# EAGLE design routeur3a (EAGLE 6.6.0)
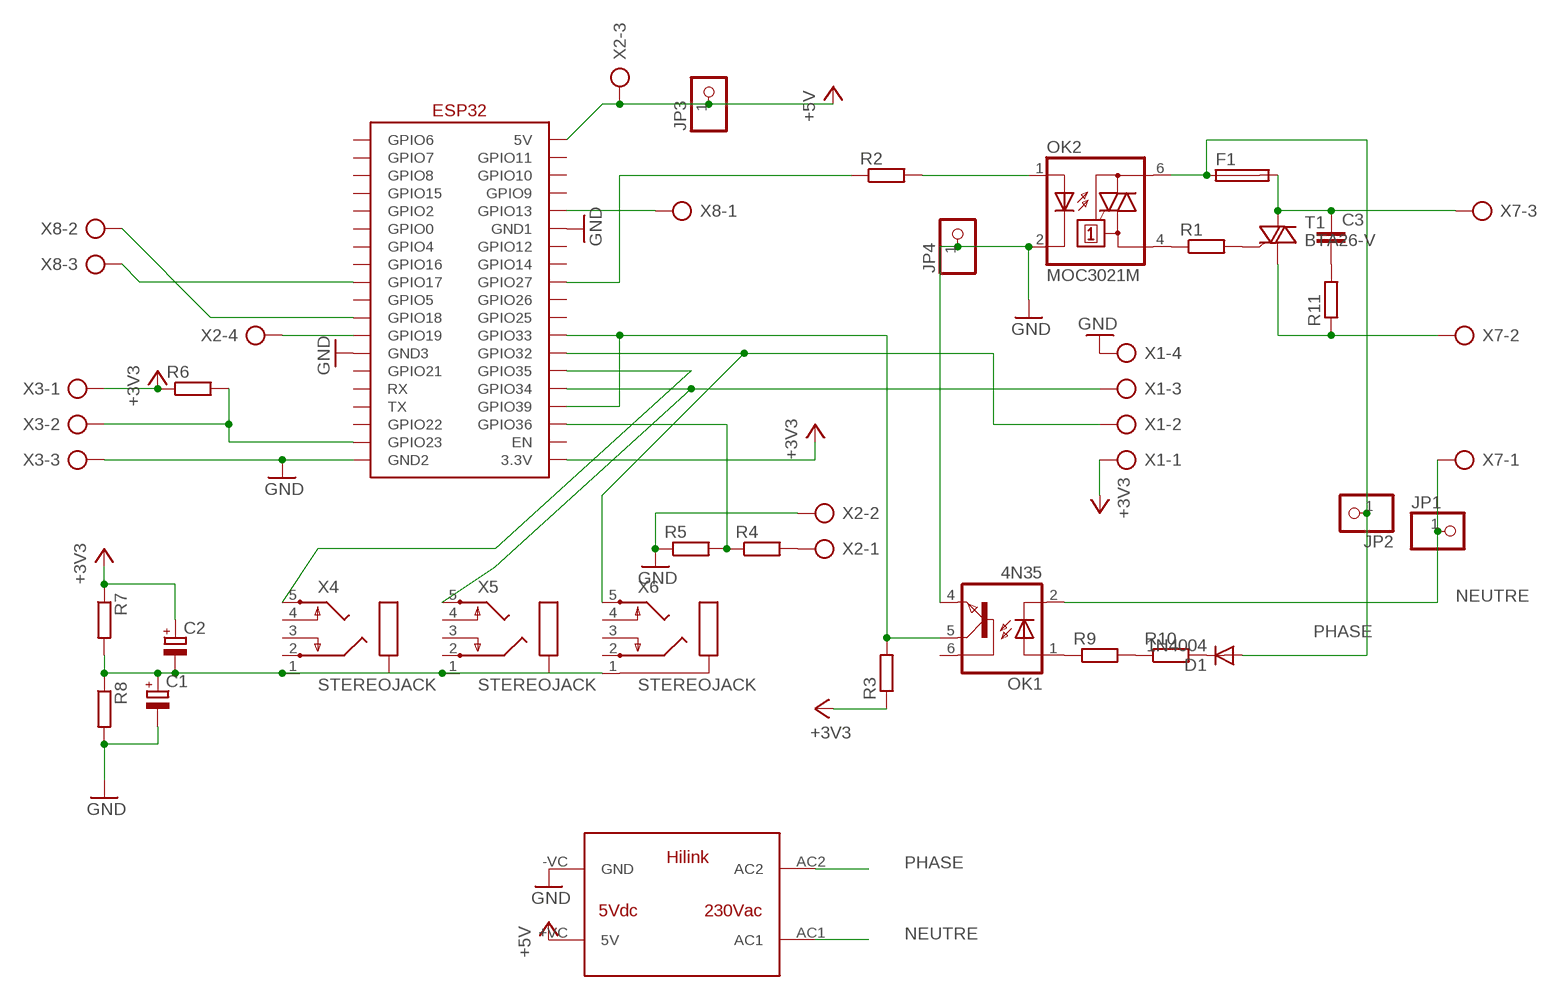
[diagram p0: schematic, sheet 1]

## Parts
C1  CPOL-EUE5-8.5  [E5-8,5]
C2  CPOL-EUE5-8.5  [E5-8,5]
C3  C-EU150-072X183  [C150-072X183]
D1  1N4004  [DO41-10]
F1  19560  [19560]
JP1  PINHD-1X1  [1X01]
JP2  PINHD-1X1  [1X01]
JP3  PINHD-1X1  [1X01]
JP4  PINHD-1X1  [1X01]
OK1  4N35  [DIL06]
OK2  MOC3021M  [DIL06]
R1  R-EU_0207/10  [0207/10]
R2  R-EU_R1206  [R1206]
R3  R-EU_R1206  [R1206]
R4  R-EU_R1206  [R1206]
R5  R-EU_R1206  [R1206]
R6  R-EU_R1206  [R1206]
R7  R-EU_R1206  [R1206]
R8  R-EU_R1206  [R1206]
R9  R-EU_0207/10  [0207/10]
R10  R-EU_0207/10  [0207/10]
R11  R-EU_0817/22  [P0817/22]
T1  BTA26-V  [TOP3S-1]
U$1  WEMOSD1ESP32  [WEMOS-D1-MINI]
U$2  HILINK  [HILINK]
X1  AK500/4  [AK500/4]
X2  AK500/4  [AK500/4]
X3  AK500/3  [AK500/3]
X4  STEREOJACK  [STX3100]
X5  STEREOJACK  [STX3100]
X6  STEREOJACK  [STX3100]
X7  AK500/3  [AK500/3]
X8  AK500/3  [AK500/3]

## Nets
+3V3: C2.+ R3.1 R6.1 R7.1 U$1.3V3(3.3V) X1.1 X3.1
+5V: JP3.1 U$1.VCC(5V) U$2.+VC(5V) X2.3
GND: C1.- JP4.1 OK1.4(EMI) OK2.2(C) R5.1 R8.2 U$1.GND2 U$1.GND3 U$1.GND(GND1) U$2.-VC(GND) X1.4 X2.2 X3.3
N$1: OK2.4(A1) R1.1
N$2: OK2.1(A) R2.2
N$3: R4.2 X2.1
N$4: R1.2 T1.G
N$5: C3.1 F1.2 T1.A2 X7.3
N$6: R11.1 T1.A1 X7.2
N$7: OK1.1(A) R9.1
N$8: R9.2 R10.1
N$9: U$1.TCK(GPIO13) X8.1
N$10: D1.C R10.2
N$14: C1.+ C2.- R7.2 R8.1 X4.1 X5.1 X6.1
N$16: C3.2 R11.2
N$17: U$1.35(GPIO35) X4.5
NEUTRE: JP1.1 OK1.2(C) U$2.AC1 X7.1
PHASE: D1.A F1.1 JP2.1 OK2.6(A2) U$2.AC2
PINCE: U$1.32(GPIO32) X1.2 X6.5
PINCEREF: U$1.34(GPIO34) X1.3 X5.5
PZEMRX: U$1.17(GPIO17) X8.3
PZEMTX: U$1.18(GPIO18) X8.2
RELAIS: U$1.19(GPIO19) X2.4
TEMP: R6.2 U$1.23(GPIO23) X3.2
TENSION: R4.1 R5.2 U$1.SVP(GPIO36)
TRIAC: R2.1 U$1.27(GPIO27)
ZC: OK1.5(COL) R3.2 U$1.33(GPIO33) U$1.SUN(GPIO39)
Unconnected: OK1.6(BAS) U$1.00(GPIO0) U$1.02(GPIO2) U$1.04(GPIO4) U$1.05(GPIO5) U$1.16(GPIO16) U$1.21(GPIO21) U$1.22(GPIO22) U$1.25(GPIO25) U$1.26(GPIO26) U$1.CLK(GPIO6) U$1.CMD(GPIO11) U$1.RST(EN) U$1.RXD(RX) U$1.SD1(GPIO8) U$1.SD2(GPIO9) U$1.SD3(GPIO10) U$1.SDO(GPIO7) U$1.TDI(GPIO12) U$1.TDO(GPIO15) U$1.TMS(GPIO14) U$1.TXD(TX) X4.2 X4.3 X4.4 X5.2 X5.3 X5.4 X6.2 X6.3 X6.4

## Library data of the parts
C1 C2 = rcl:CPOL-EU: POLARIZED CAPACITOR, European symbol
C3 = rcl:C-EU: CAPACITOR, European symbol
D1 = diode:1N4004: DIODE general purpose rectifier, 1 A
F1 = fuse:19560: FUSE HOLDER TR5, Wickmann; MPN: 56000001009; OC_FARNELL: 1185363; OC_NEWARK: 15P8392
JP1-JP4 = adafruit:PINHD-1X1: Pin header 1x1 for 0.1" spacing With round pins
OK1 = optocoupler:4N35: MOTOROLA OPTO COUPLER; MF: FAIRCHILD SEMICONDUCTOR; MPN: 4N35; OC_FARNELL: 1328375; OC_NEWARK: 72K9946
OK2 = optocoupler:MOC30*M: RANDOM-PHASE OPTOISOLATORS TRIAC DRIVER OUTPUT Source: http://www.fairchildsemi.com MOC3020-M.pdf; MF: FAIRCHILD SEMICONDUCTOR; MPN: MOC3021-M; OC_FARNELL: 1021365; OC_NEWARK: 95B7895
R1 R9 R10 = rcl:R-EU_: RESISTOR, European symbol
R2-R8 R11 = resistor:R-EU_: RESISTOR, European symbol
T1 = triac:BTA26: 25A TRIAC Source: http://www.st.com/stonline/products/literature/ds/7470.pdf
U$1 = esp32:WEMOSD1ESP32
U$2 = hilink:HILINK
X1 X2 = con-ptr500:AK500/4: CONNECTOR; OC_FARNELL: unknown; OC_NEWARK: unknown
X3 X7 X8 = con-ptr500:AK500/3: CONNECTOR; OC_FARNELL: unknown; OC_NEWARK: unknown
X4-X6 = adafruit:STEREOJACK: MIC/HEADPHONE JACK Stereo jack with two switches. Kycon STX3100, CUI SJ1-3555NG and/or 4UCon 05544

## Board
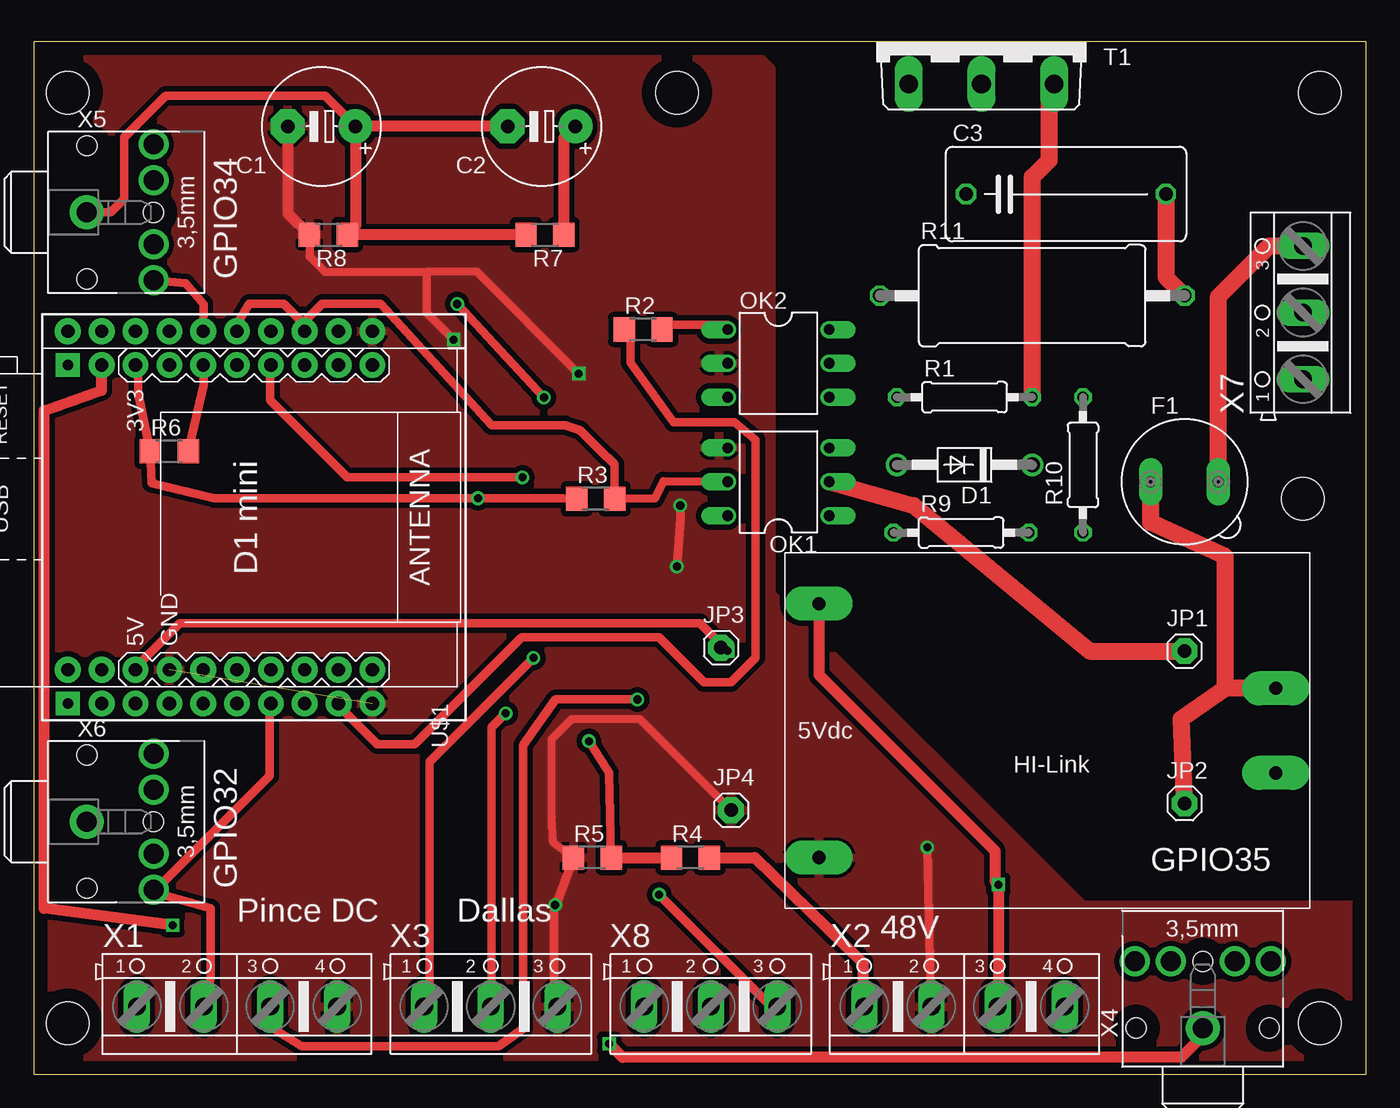
[diagram p1: board, top side]
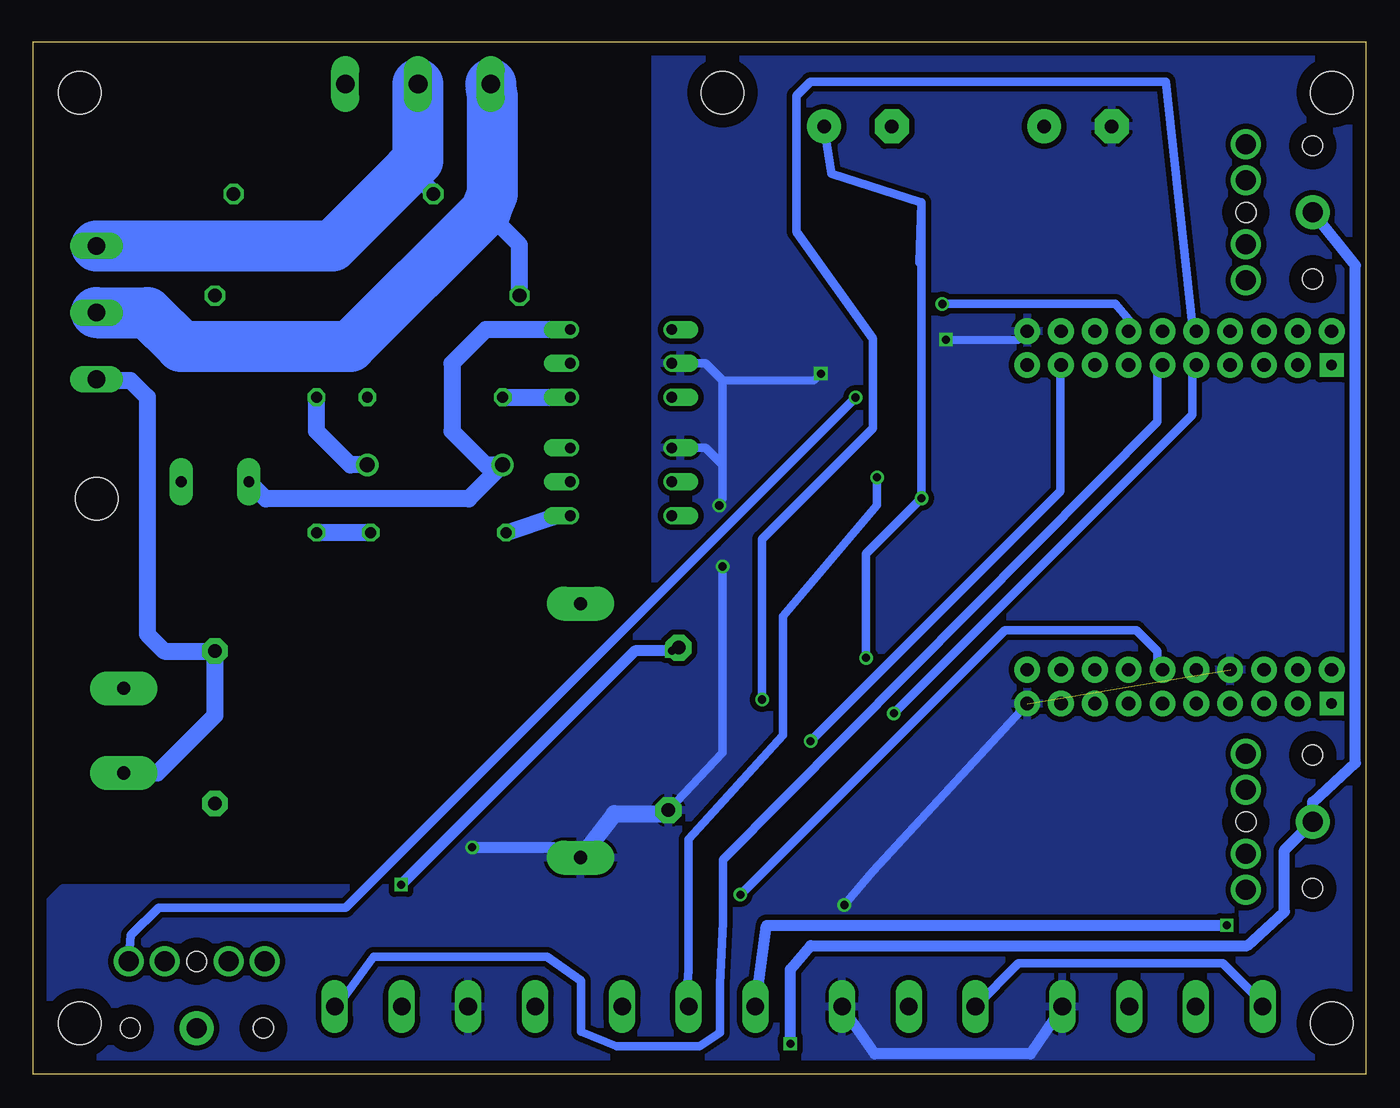
[diagram p2: board, bottom side, seen from below]

Size 100 x 77.46 mm. Coordinates in mm from the lower left corner, seen from the top.
Outline: 0,0 100,0 100,77.46 0,77.46 0,0
Copper layers (1*16): Top 0.035mm / dielectric 1.5mm / Bottom 0.035mm
Design rules "default *": minimum track width 25mil, minimum drill 24mil, track to track 16mil, track to pad 16mil, pad to pad 8mil, via to via 8mil, smd to smd 8mil, copper to edge 40mil, drill to drill 8mil, minimum pad ring 10mil, minimum via ring 8mil, stop-mask expansion 4mil, vias tented up to drill 0mil, thermal gap 10mil
Holes 3.2 mm at 96.52,73.66 95.25,43.18 2.54,3.81 96.52,3.81 2.54,73.66 48.26,73.66

### Footprints (pad centres in the part's own frame; a part is rotated, then mirrored left to right if it is on the bottom)
E5-8,5 = drill 1.016 pad 2.54: + -2.54,0 | drill 1.016 pad 2.54 octagon: - 2.54,0
C150-072X183 = drill 1.016 octagon: 1 -7.493,0; 2 7.493,0
DO41-10 = drill 1.118: A 5.08,0; C -5.08,0
19560 = drill 0.813 pad 1.778 long: 1 -2.54,0; 2 2.54,0
1X01 = drill 1.016 pad 1.93 octagon: 1 0,0
DIL06 = drill 0.813 offset: 1 -2.54,-3.81; 2 0,-3.81; 3 2.54,-3.81; 4 2.54,3.81; 5 0,3.81; 6 -2.54,3.81
0207/10 = drill 0.813 octagon: 1 -5.08,0; 2 5.08,0
R1206 = smd 1.6 x 1.803: 1 -1.422,0; 2 1.422,0
P0817/22 = drill 1.016 octagon: 1 -11.43,0; 2 11.43,0
TOP3S-1 = drill 1.397 long: A1 -5.461,-3.175; A2 0,-3.175; G 5.461,-3.175
WEMOS-D1-MINI = drill 1 pad 1.93: 00 15.24,-8.255; 02 15.24,-10.795; 3V3 -10.16,-10.795; 04 15.24,-5.715; 05 -10.16,-8.255; 16 12.7,-5.715; 17 12.7,-3.175; 18 -10.16,-0.635; 19 -10.16,-3.175; 21 12.7,-0.635; 22 12.7,1.905; 23 -10.16,-5.715; 25 15.24,1.905; 26 -10.16,1.905; 27 15.24,4.445; 32 15.24,-0.635; 33 -12.7,-3.175; 34 -12.7,-5.715; 35 -12.7,-0.635; CMD -12.7,-15.875; GND 15.24,6.985; GND2 12.7,-8.255; GND3 -12.7,6.985; NC -12.7,4.445; NC2 -12.7,-10.795; RST -10.16,6.985; RXD 12.7,4.445; SD1 15.24,-13.335; SD2 -12.7,-13.335; SDO 12.7,-15.875; SUN -12.7,1.905; SVP -10.16,4.445; TCK -10.16,-13.335; TDI 15.24,-3.175; TDO 12.7,-13.335; TMS -12.7,-8.255; TXD 12.7,6.985; VCC 12.7,-10.795 | drill 0.8 pad 1.778 square: CLK 15.24,-15.875; SD3 -10.16,-15.875
HILINK = drill 1 pad 2.54 long: +VC 8.89,-7.62; -VC 8.89,11.43; AC1 -25.4,5.08; AC2 -25.4,-1.27
AK500/4 = drill 1.321 long: 1 -7.518,0; 2 -2.489,0; 3 2.489,0; 4 7.518,0
AK500/3 = drill 1.321 long: 1 -5.004,0; 2 0,0; 3 5.004,0
STX3100 = drill 1.5 pad 2.54: 1 2.7,-0.1 | drill 1.5: 2 7.7,5; 3 7.7,2.3; 4 7.7,-2.5; 5 7.7,-5.2 | hole 1.5: 2.7,4.9; 2.7,-5.1; 7.7,-0.1

### Placement (x,y rotation side)
C1  21.59,71.12 180 top
C2  38.1,71.12 180 top
C3  77.47,66.04 0 top
D1  69.85,45.72 180 top
F1  86.36,44.45 0 top
JP1  86.36,31.75 0 top
JP2  86.36,20.32 0 top
JP3  51.56,32 0 top
JP4  52.32,19.81 0 top
OK1  55.88,44.45 90 top
OK2  55.88,53.34 270 top
R1  69.85,50.8 0 top
R2  45.72,55.88 0 top
R3  42.16,43.18 0 top
R4  49.28,16.26 0 top
R5  41.91,16.26 0 top
R6  10.16,46.74 0 top
R7  38.35,62.99 180 top
R8  22.1,62.99 180 top
R9  69.6,40.64 0 top
R10  78.74,45.72 90 top
R11  74.93,58.42 0 top
T1  71.12,77.47 0 top
U$1  18.41,43.05 270 top
U$2  67.82,27.69 180 top
X1  15.24,5.08 0 top
X2  69.85,5.08 0 top
X3  34.29,5.08 0 top
X4  87.63,0.76 90 top
X5  1.27,64.77 0 top
X6  1.27,19.05 0 top
X7  95.25,57.15 90 top
X8  50.8,5.08 0 top

### Tracks (layer width: path | path; a pad name or v marks a point on that pad's centre or on a via)
+3V3  (via drill 0.61)
  Top 0.635: U$1.3V3 7.81,53.11 7.82,53.1 7.82,51.11 R6.1 8.85,44.35 13.54,43.22 v33.33,43.22 39.69,43.22 R3.1 | v37.49,31.24 29.68,23.43 29.68,5.21 X3.1
  Top 0.813: R7.1 39.78,70.26 C2.+
  Bottom 0.635: X3.1 26.05,8.32 10.71,8.32 7.59,5.21 7.81,5.21 X1.1 | 33.33,65.44 33.43,65.44 40.11,67.55 C2.+ | 33.33,65.44 33.48,60.87 | 33.33,65.44 v33.33,43.22 37.49,39.05 v37.49,31.24
+5V  (via drill 0.6)
  Top 0.635: U$1.VCC 7.81,30.72 10.94,33.85 49.99,33.85 v52.07,31.76 JP3.1
  Top 0.813: X2.3 72.39,5.13 v72.39,14.22 72.14,14.48 72.14,16.76 58.93,29.97 U$2.+VC
  Bottom 0.813: v52.07,31.76 54.85,31.76 v72.39,14.22
GND  (via drill 0.6, 0.61)  (1 unrouted)
  Top 0.61: v40.89,52.58 33.27,60.2 29.46,60.2 | 29.46,60.2 29.46,57.15 v31.5,55.12 | R8.2 20.68,61.37 21.84,60.2 29.46,60.2 | R5.1 38.96,17.42 38.86,19.3 38.86,25.15 40.39,26.67 45.47,26.67 JP4.1
  Top 0.635: 39.05,12.7 39.05,5.21 X3.3 | 39.05,12.7 39.31,12.97 R5.1 | v67.06,17.02 67.31,5.13 X2.2 | v48.26,38.1 48.51,41.66 v48.51,42.67 | v39.12,12.7 39.05,12.7
  Top 0.813: C1.- 19.05,64.62 R8.2
  Bottom 0.61: 48.26,52.07 41.4,52.07 v40.89,52.58 | v31.5,55.12 26.04,55.12 U$1.GND3
  Bottom 0.635: JP4.1 48.26,24.13 v48.26,38.1 | v48.51,42.67 48.26,43.18 48.26,45.72 | 48.26,45.72 49.53,46.99 OK1.4 | 48.26,45.72 48.26,52.07 49.53,53.34 OK2.2 52.39,53.34 | U$1.GND 36.96,15.24 v39.12,12.7
  Bottom 0.813: v67.06,17.02 60.96,17.02 U$2.-VC | X1.4 25.15,1.52 36.83,1.52 X3.3
  Bottom 1.27: U$2.-VC 56.39,19.56 52.58,19.56 JP4.1
  pour Bottom: -5.84,77.47 53.34,77.47 53.34,34.29 54.61,34.29 74.93,13.97 97.79,13.97 100.33,11.43 100.33,0 -8.64,0.25
  pour Top: -8.38,77.72 53.34,77.47 55.37,75.44 55.37,36.07 78.74,12.7 99.06,12.7 100.33,11.43 100.33,0 -8.89,0.25
N$1
  Bottom 1.27: R1.1 OK2.4
N$2
  Top 0.635: R2.2 47.38,56.24 52.07,56.24 OK2.1
N$3
  Top 0.635: 62.46,4.97 62.22,5.21 X2.1
  Top 0.813: R4.2 54.1,16.26 62.23,8.38 62.23,5.44 X2.1
N$4
  Top 1.27: R1.2 74.93,67.31 76.2,68.58 76.2,73.91 T1.G
N$5
  Top 1.27: F1.2 88.9,58.34 92.71,62.15 X7.3
  Bottom 1.27: C3.1 69.98,66.17 71.75,67.94
  Bottom 3.81: X7.3 77.55,62.15 71.75,67.94 71.12,68.58 T1.A2
N$6
  Bottom 1.27: R11.1 63.5,62.23 66.04,64.77
  Bottom 3.81: X7.2 91.44,57.15 88.9,54.61 76.2,54.61 66.04,64.77 65.53,66.04 65.53,73.41 T1.A1
N$7
  Bottom 1.27: R9.1 60.71,41.91 OK1.1
N$8
  Bottom 1.27: R9.2 R10.1
N$9  (via drill 0.6)
  Top 0.813: v10.41,11.18 0.76,12.45 0.76,49.78 5.08,51.31 U$1.TCK
  Bottom 0.813: X8.1 44.96,11.18 v10.41,11.18
N$10
  Bottom 1.27: D1.C 76.2,45.72 78.74,48.26 R10.2
N$14  (via drill 0.6)
  Top 0.635: X5.1 5.74,64.67 6.77,65.7 6.77,70.29 9.89,73.42 21.87,73.42 23.77,71.52 23.95,71.34 C1.+
  Top 0.813: R7.2 R8.1 24.13,63.6 C1.+ | C2.- 24.17,71.12 23.77,71.52 | X4.1 87.73,2.89 86.11,1.27 44.2,1.27 v43.18,2.29
  Bottom 0.813: X5.1 0.76,60.7 0.76,23.37 3.97,20.41 X6.1 6.1,16.82 6.1,12.19 8.89,9.65 41.66,9.65 43.18,7.87 v43.18,2.29
N$16
  Top 1.27: C3.2 84.96,59.82 R11.2
N$17  (via drill 0.61)
  Top 0.635: v38.28,50.77 v31.76,57.8
  Bottom 0.635: U$1.35 17.78,56.62 18.77,57.8 v31.76,57.8 | v38.28,50.77 48.95,40.11 48.95,40.09 76.54,12.5 90.6,12.5 92.69,10.41 X4.5
NEUTRE
  Top 1.27: OK1.2 66.04,42.67 79.25,31.75 JP1.1
  Bottom 1.27: X7.1 95.17,52.07 92.71,52.07 91.44,50.8 91.44,33.02 90.17,31.75 JP1.1 86.36,26.92 90.68,22.61 U$2.AC1
PHASE
  Top 1.27: JP2.1 86.36,20.83 86.11,26.67 89.41,28.96 | 89.41,28.96 89.41,38.86 83.82,41.4 F1.1 | U$2.AC2 89.41,28.96
  Bottom 1.27: OK2.6 66.04,55.88 68.58,53.34 68.58,48.26 66.04,45.72 D1.A 67.31,43.18 82.55,43.18 F1.1
PINCE
  Top 0.635: U$1.32 17.7,27.6 17.7,22.39 9.37,14.06 X6.5 9.37,13.54 13.26,12.45 13.26,7.24 X1.2
PINCEREF  (via drill 0.61)
  Top 0.635: U$1.34 12.75,57.76 11.4,59.36 X5.5 | v45.3,28.12 39.14,28.12 36.73,24.69 36.73,3.42 34.89,2.08 20.09,2.08 18,3.42 17.72,4.94 X1.3
  Bottom 0.635: v45.3,28.12 45.3,40.15 36.97,48.48 36.97,55.19 42.7,63.21 42.7,73.42 41.66,74.46 14.99,74.46 13.02,56.24 U$1.34
PZEMRX  (via drill 0.61)
  Top 0.635: v46.93,13.47 55.72,4.69 X8.3
  Bottom 0.635: v46.93,13.47 27.08,33.33 17.21,33.33 15.62,31.74 15.62,30.72 U$1.17
PZEMTX  (via drill 0.61)
  Top 0.635: U$1.18 17.72,53.15 17.72,50.56 23.5,44.78 v36.66,44.78
  Bottom 0.635: v36.66,44.78 36.66,42.71 43.74,34.37 43.74,25.44 50.8,17.61 50.8,7.77 51.03,5.21 X8.2
RELAIS
  Bottom 0.635: U$1.19 15.62,53.11 15.62,48.95 48.23,16.08 48.23,11.39 48.44,6.77 48.44,3.12 49.99,2.08 56.24,2.08 58.88,3.2 58.88,7.02 61.44,8.83 74.46,8.83 77.06,5.21 X2.4
TEMP  (via drill 0.61)
  Top 0.635: U$1.23 12.74,53.17 12.74,51.69 R6.2 | v35.41,27.08 34.37,26.04 34.37,5.21 X3.2
  Bottom 0.635: v35.41,27.08 13.02,49.47 13.02,53.11 U$1.23
TENSION  (via drill 0.61)
  Top 0.635: v41.66,24.99 43.18,22.63 R5.2
  Top 0.813: R5.2 R4.1
  Bottom 0.635: v41.66,24.99 22.91,43.74 22.91,53.11 U$1.SVP
TRIAC
  Top 0.635: R2.1 44.78,55.72 44.78,53.4 48.01,48.91 52.59,48.91 54.15,47.6 54.15,31.24 52.34,29.43 50.28,29.43 46.9,32.8 36.61,32.8 28.57,24.77 25.74,24.77 22.91,27.6 U$1.27
ZC
  Top 0.635: OK1.5 47.24,44.49 46.62,43.22 R3.2 43.56,45.76 42.52,46.8 41,48.34 39.87,48.7 34.37,48.7 26.04,57.8 21.63,57.8 20.07,56.24 U$1.SUN 20.31,56.24 18.75,57.8 16.17,57.8 15.37,56.49 U$1.33

### Text on the board
tNames: GPIO34 | GPIO35 | GPIO32 | Pince DC | Dallas | 48V